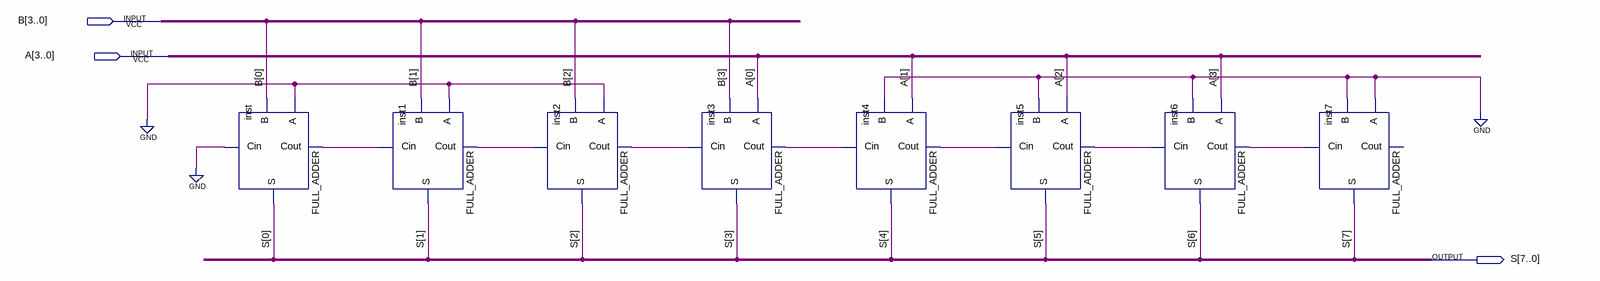
[diagram p0: schematic sheet]
// Quartus schematic ADDER.bdf as structural Verilog: 8 symbols, 3 pins
module ADDER (
  input  [3:0] B,
  input  [3:0] A,
  output [7:0] S
);

  wire inst1_cout, inst2_cout, inst3_cout, inst4_cout, inst5_cout, inst6_cout, inst_cout;

  FULL_ADDER inst (.A(1'b0), .B(B[0]), .Cin(1'b0), .S(S[0]), .Cout(inst_cout));
  FULL_ADDER inst1 (.A(1'b0), .B(B[1]), .Cin(inst_cout), .S(S[1]), .Cout(inst1_cout));
  FULL_ADDER inst2 (.A(1'b0), .B(B[2]), .Cin(inst1_cout), .S(S[2]), .Cout(inst2_cout));
  FULL_ADDER inst3 (.A(A[0]), .B(B[3]), .Cin(inst2_cout), .S(S[3]), .Cout(inst3_cout));
  FULL_ADDER inst4 (.A(A[1]), .B(1'b0), .Cin(inst3_cout), .S(S[4]), .Cout(inst4_cout));
  FULL_ADDER inst5 (.A(A[2]), .B(1'b0), .Cin(inst4_cout), .S(S[5]), .Cout(inst5_cout));
  FULL_ADDER inst6 (.A(A[3]), .B(1'b0), .Cin(inst5_cout), .S(S[6]), .Cout(inst6_cout));
  FULL_ADDER inst7 (.A(1'b0), .B(1'b0), .Cin(inst6_cout), .S(S[7]));  // open: Cout
endmodule
